# Altium schematic sheet SIM.SchDoc
size A4; SheetNumber: 9; SheetTotal: 11
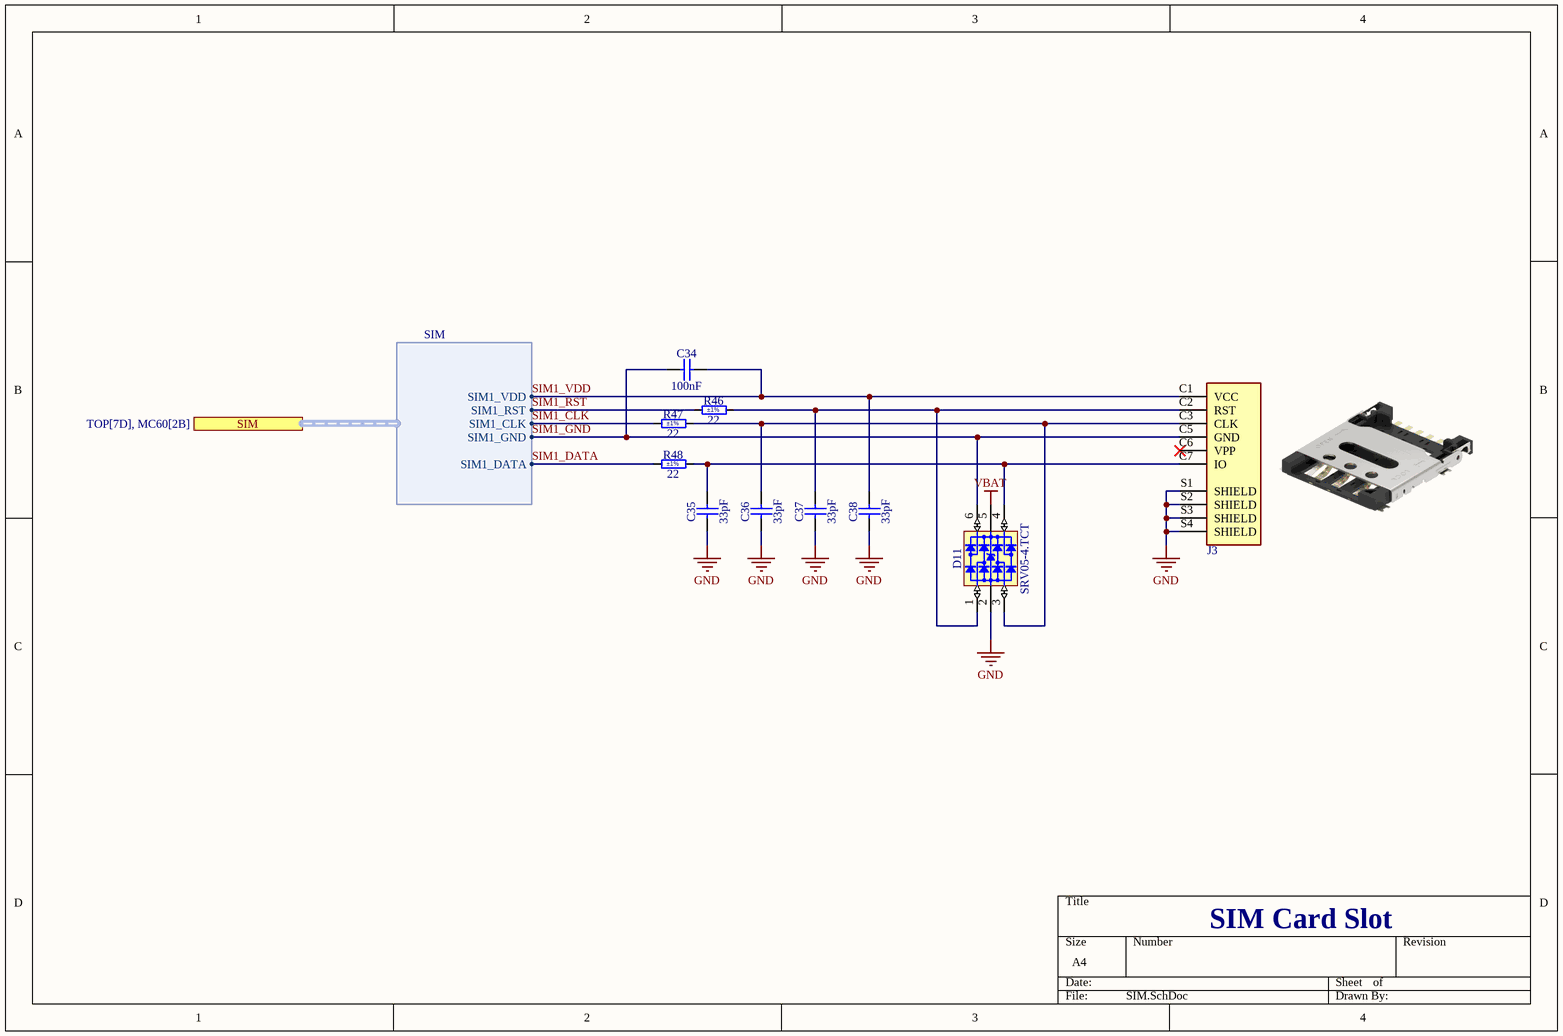
[diagram p0: SIM.SchDoc]

## Parts
C34  100nF  [CAPC1608X87N]
C35  33pF  [CAPC1608X87N]
C36  33pF  [CAPC1608X87N]
C37  33pF  [CAPC1608X87N]
C38  33pF  [CAPC1608X87N]
D11  SRV05-4.TCT  [SOT95P280X145-6N]
J3  SIM8060-6-0-14-00-A  [GCT_SIM8060-6-0-14-00-A]  (value not drawn)
R46  22  Tolerance: ±1%  [RESC1608X55N]
R47  22  Tolerance: ±1%  [RESC1608X55N]
R48  22  Tolerance: ±1%  [RESC1608X55N]

## Ports
SIM (harness SIM, see TOP[7D], MC60[2B])

## Harnesses
SIM: SIM1_VDD, SIM1_RST, SIM1_CLK, SIM1_GND, SIM1_DATA

## Nets
GND: C35.1 C36.1 C37.1 C38.1 D11.2(GND) J3.S1(SHIELD) J3.S2(SHIELD) J3.S3(SHIELD) J3.S4(SHIELD)
VBAT: D11.5(VBUS)
SIM1_CLK: R47.1 ; port SIM.SIM1_CLK
SIM1_DATA: R48.1 ; port SIM.SIM1_DATA
SIM1_GND: C34.1 D11.6(I/O4) J3.C5(GND) ; port SIM.SIM1_GND
SIM1_RST: R46.1 ; port SIM.SIM1_RST
SIM1_VDD: C34.2 C38.2 J3.C1(VCC) ; port SIM.SIM1_VDD
NetC35_2: C35.2 D11.4(I/O3) J3.C7(IO) R48.2
NetC36_2: C36.2 D11.3(I/O2) J3.C3(CLK) R47.2
NetC37_2: C37.2 D11.1(I/O1) J3.C2(RST) R46.2

Not connected (* = marked no-connect by the designer): J3 C6(VPP)*

## Notes on the sheet
- SIM Card Slot

## Library data of the parts
C34 = CC0603_100NF_50V_10%_X7R: Non-polarised capacitor; Part Description: SMD Multilayer Chip Ceramic Capacitor; Manufacturer: GENERIC; Manufacturer1 Part Number: 223858615649; Voltage: 50V; TC: X7R; Tolerance: ±10%; Part Number: CC0603_100NF_50V_10%_X7R; Component Kind: Standard; Component Type: Standard; Pin Count: 2; Value: 100nF; Status: Preferred; Manufacturer Part Number: CC0603_100NF_50V_10%_X7R; Case: 0603; Mounted: Yes; Socket: No; SMD: Yes; Sense: No; Manufacturer1 Example: PHYCOMP; Manufacturer1 ComponentHeight: 0.87mm; HelpURL: \\cern.ch\dfs\Applications\Altium\Datasheets\CC0603_X7R_PHYCOMP.pdf; Author: CERN DEM JLC; CreateDate: 03.12.2007; LatestRevisionDate: 03.12.2007
C35-C38 = CC0603_33PF_50V_5%_NP0: Non-polarised capacitor; Part Description: SMD Multilayer Chip Ceramic Capacitor; Manufacturer: GENERIC; Manufacturer1 Part Number: 223886715339; Voltage: 50V; TC: C0G/NP0; Tolerance: ±5%; Part Number: CC0603_33PF_50V_5%_NP0; Component Kind: Standard; Component Type: Standard; Pin Count: 2; Value: 33pF; Status: Preferred; Manufacturer Part Number: CC0603_33PF_50V_5%_NP0; Case: 0603; Mounted: Yes; Socket: No; SMD: Yes; Sense: No; Manufacturer1 Example: PHYCOMP; Manufacturer1 ComponentHeight: 0.87mm; HelpURL: \\cern.ch\dfs\Applications\Altium\Datasheets\CC0603_NP0_PHYCOMP.pdf; Author: CERN DEM JLC; CreateDate: 03.12.2007; LatestRevisionDate: 03.12.2007
D11 = SRV05-4.TCT: RailClamps Low Capacitance TVS Diode Array; Part Description: RailClamps Low Capacitance TVS Diode Array, ESD (15kV) Protection; Manufacturer: SEMTECH; Power: 300W; PressFit: No; Bonding: No; Part Number: SRV05-4.TCT; Component Kind: Standard; Component Type: Standard; Device: SRV05-4.TCT; PackageDescription: SOT, 0.95mm Pitch; 6 Pin, 1.60mm W X 3.00mm L X 1.45mm H body, IPC Medium Density; Status: Not recommended; Manufacturer Part Number: SRV05-4.TCT; Pin Count: 6; Case: SOT23-6; Mounted: Yes; Socket: No; SMD: Yes; Sense: No; ComponentHeight: 1.45mm; HelpURL: \\cern.ch\dfs\Applications\Altium\Datasheets\SRV05-4.TCT.pdf; Author: CERN DEM JLC; CreateDate: 22.07.2013; LatestRevisionDate: 22.07.2013
J3 = GCT_SIM8060-6-0-14-00-A: 6 Position Card Connector NANO SIM Surface Mount, Right Angle Gold; Manufacturer: GCT; MF: Global Connector Technology; Mounted: No; MP: SIM8060-6-0-14-00-A; Package: Package Analog Devices; Price: None; Availability: Unavailable; SnapEDA_Link: https://www.snapeda.com/parts/SIM8060-6-0-14-00-A/Global%20Connector%20Technology/view-part/3214904/?ref=snap; Value: *; Part Number: GCT_SIM8060-6-0-14-00-A; Pin Count: 6; Family: SIM8060; Socket: No; SMD: Yes; Sense: No; Status: None; Device: SIM8060-6-0-14-00-A; Part Description: 6 Position Card Connector NANO SIM Surface Mount, Right Angle Gold; Manufacturer Part Number: SIM8060-6-0-14-00-A; ComponentHeight: 1.4mm; HelpURL: https://media.digikey.com/pdf/Data%20Sheets/GCT%20PDFs/SIM8060_Spec.pdf; Author: Xusniyor; CreateDate: 30.04.2023; LatestRevisionDate: 30.04.2023
R46-R48 = R0603_22R_1%_0.1W_100PPM: Resistor - 1%; Part Description: General Purpose Thick Film Chip Resistor; Manufacturer: GENERIC; Manufacturer1 Part Number: NRC06F22R0TRF; Power: 0.1W; TC: ±100ppm/°C; PressFit: No; Part Number: R0603_22R_1%_0.1W_100PPM; Component Kind: Standard; Component Type: Standard; Pin Count: 2; Value: 22; Status: Preferred; Manufacturer Part Number: R0603_22R_1%_0.1W_100PPM; Case: 0603; Mounted: Yes; Sense: No; Socket: No; SMD: Yes; Manufacturer1 Example: NIC COMPONENT; Manufacturer1 ComponentHeight: 0.55mm; HelpURL: \\cern.ch\dfs\Applications\Altium\Datasheets\R0603_NIC_NRC.pdf; Author: CERN DEM JLC; CreateDate: 03.12.2007; LatestRevisionDate: 13.03.2008